# EAGLE design sensor Destama RN (EAGLE 9.6.2)
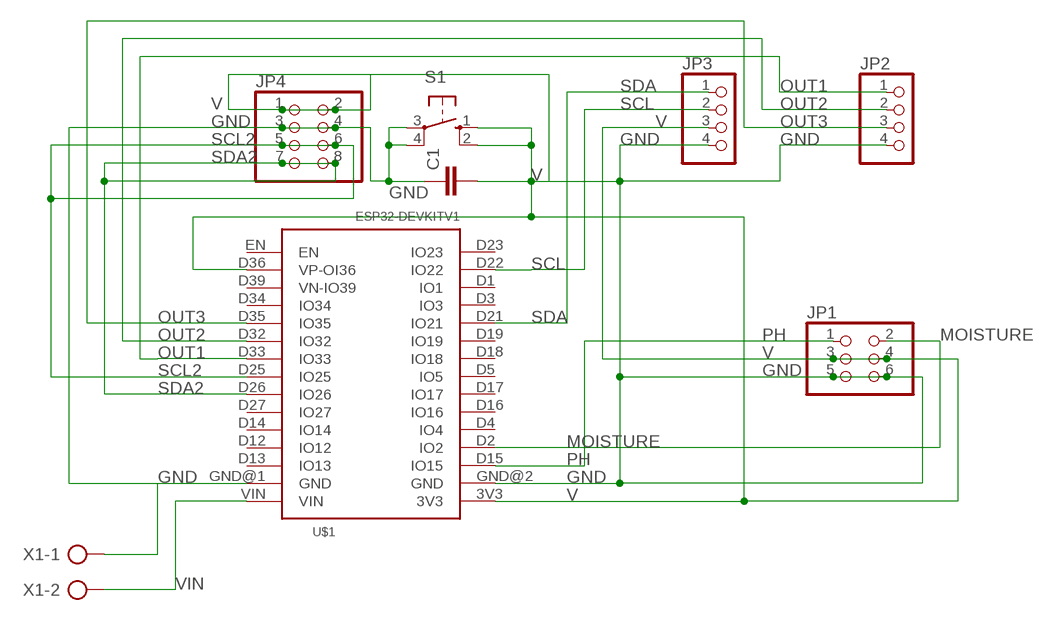
[diagram p0: schematic, sheet 1]

## Parts
C1  C-EU050-030X075  [C050-030X075]
JP1  PINHD-2X3  [2X03]
JP2  PINHD-1X4  [1X04]
JP3  PINHD-1X4  [1X04]
JP4  PINHD-2X4  [2X04]
S1  10-XX  [B3F-10XX]
U$1  ESP32DEVKITV1  [ESP32-DEVKITV1]
X1  AK300/2  [AK300/2]

## Nets
GND: C1.1 JP1.5 JP1.6 JP2.4 JP3.4 JP4.3 JP4.4 S1.3(P) S1.4(P1) U$1.GND@1(GND) U$1.GND@2(GND) X1.1
MOISTURE: JP1.2 U$1.D2(IO2)
OUT1: JP2.1 U$1.D33(IO33)
OUT2: JP2.2 U$1.D32(IO32)
OUT3: JP2.3 U$1.D35(IO35)
PH: JP1.1 U$1.D15(IO15)
SCL: JP3.2 U$1.D22(IO22)
SCL2: JP4.5 JP4.6 U$1.D25(IO25)
SDA: JP3.1 U$1.D21(IO21)
SDA2: JP4.7 JP4.8 U$1.D26(IO26)
V: C1.2 JP1.3 JP1.4 JP3.3 JP4.1 JP4.2 S1.1(S) S1.2(S1) U$1.3V3 U$1.D36(VP-OI36)
VIN: U$1.VIN X1.2
Unconnected: U$1.D1(IO1) U$1.D3(IO3) U$1.D4(IO4) U$1.D5(IO5) U$1.D12(IO12) U$1.D13(IO13) U$1.D14(IO14) U$1.D16(IO16) U$1.D17(IO17) U$1.D18(IO18) U$1.D19(IO19) U$1.D23(IO23) U$1.D27(IO27) U$1.D34(IO34) U$1.D39(VN-IO39) U$1.EN

## Library data of the parts
C1 = rcl:C-EU: CAPACITOR, European symbol; SPICEPREFIX: C
JP1 = pinhead:PINHD-2X3: PIN HEADER
JP2 JP3 = pinhead:PINHD-1X4: PIN HEADER
JP4 = pinhead:PINHD-2X4: PIN HEADER
S1 = switch-omron:10-XX: OMRON SWITCH; MPN: B3F-1000; OC_FARNELL: 176432; OC_NEWARK: 36M3542
U$1 = esp32-devkitv1:ESP32DEVKITV1
X1 = con-ptr500:AK300/2: CONNECTOR; OC_FARNELL: unknown; OC_NEWARK: unknown

## Board
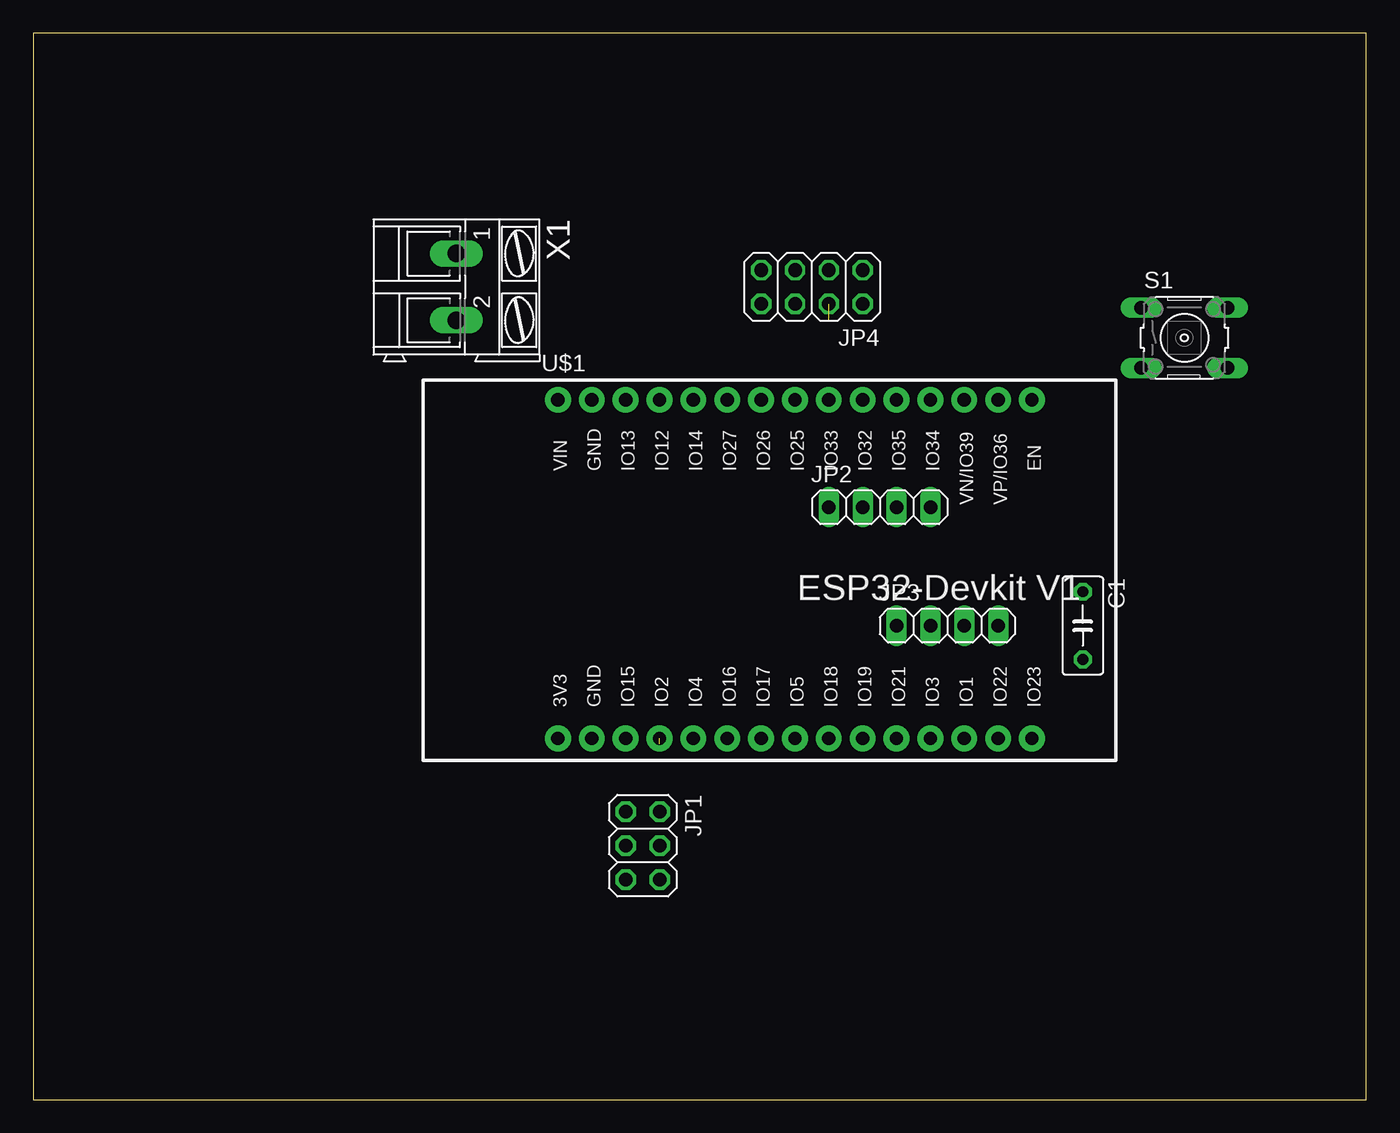
[diagram p1: board, top side]
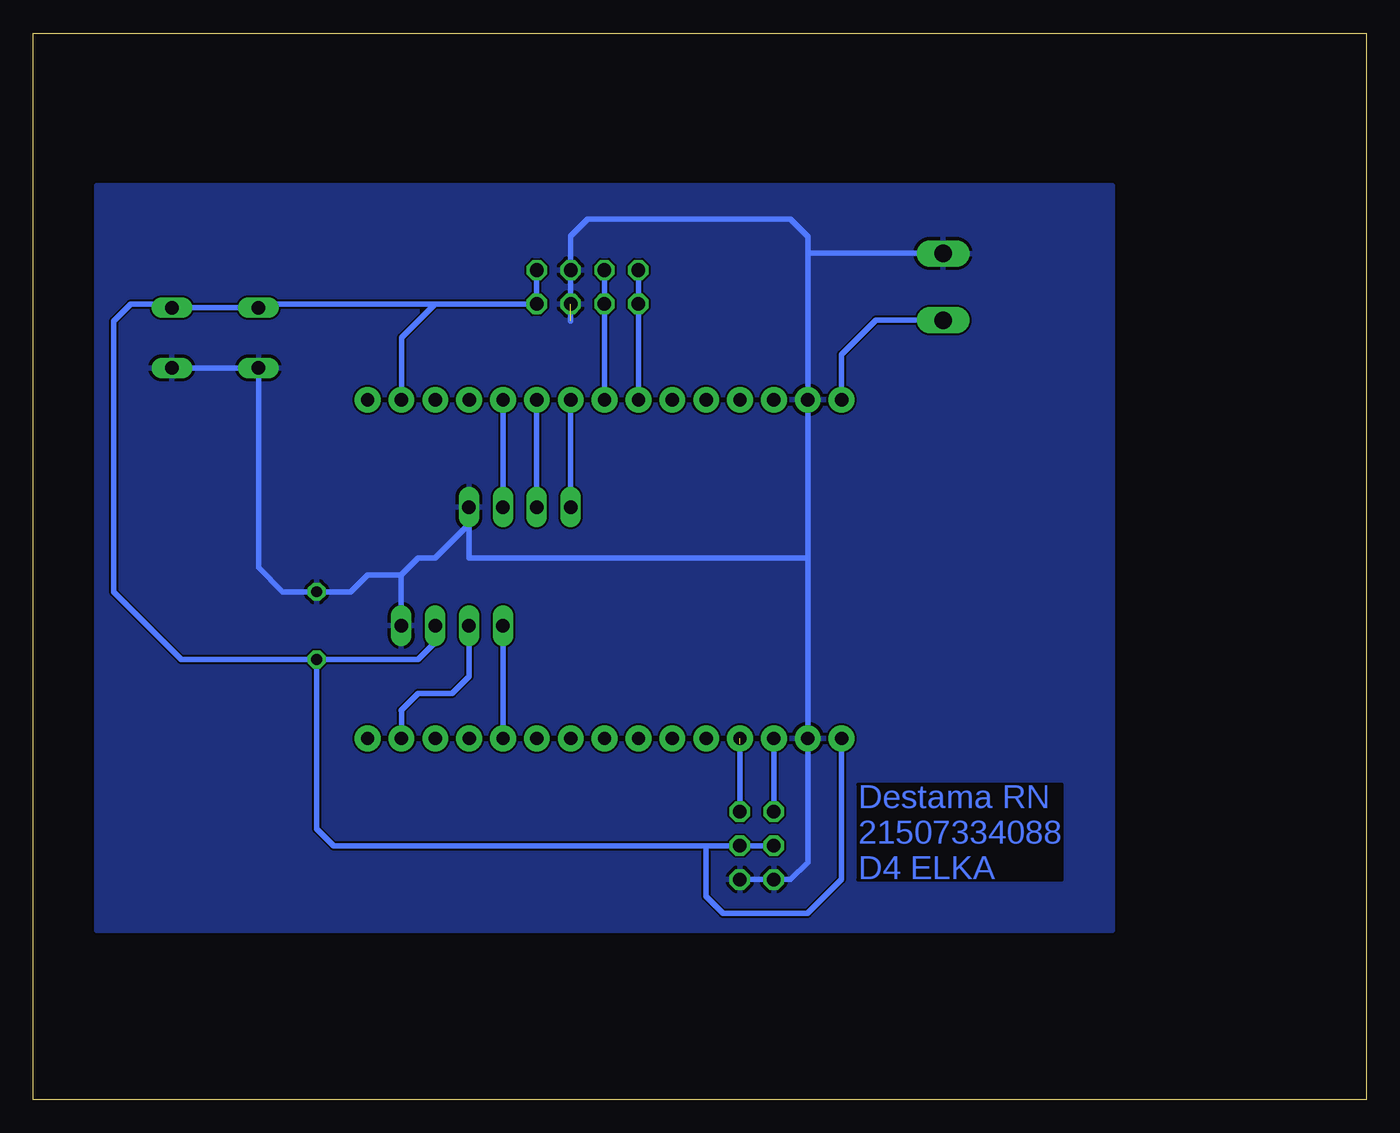
[diagram p2: board, bottom side, seen from below]

Size 100 x 80 mm. Coordinates in mm from the lower left corner, seen from the top.
Outline: 0,0 100,0 100,80 0,80 0,0
Copper layers (1*16): Top 0.035mm / dielectric 1.5mm / Bottom 0.035mm
Design rules "default": minimum track width 6mil, minimum drill 0.35mm, track to track 6mil, track to pad 6mil, pad to pad 6mil, via to via 6mil, smd to smd 6mil, copper to edge 40mil, drill to drill 6mil, minimum pad ring 10mil, minimum via ring 8mil, stop-mask expansion 4mil, vias tented up to drill 0mil, thermal gap 10mil

### Footprints (pad centres in the part's own frame; a part is rotated, then mirrored left to right if it is on the bottom)
C050-030X075 = drill 0.813 octagon: 1 -2.54,0; 2 2.54,0
2X03 = drill 1.016 octagon: 1 -2.54,-1.27; 2 -2.54,1.27; 3 0,-1.27; 4 0,1.27; 5 2.54,-1.27; 6 2.54,1.27
1X04 = drill 1.016 long: 1 -3.81,0; 2 -1.27,0; 3 1.27,0; 4 3.81,0
2X04 = drill 1.016 octagon: 1 -3.81,-1.27; 2 -3.81,1.27; 3 -1.27,-1.27; 4 -1.27,1.27; 5 1.27,-1.27; 6 1.27,1.27; 7 3.81,-1.27; 8 3.81,1.27
B3F-10XX = drill 1.016 long: 1 -3.251,2.261; 2 3.251,2.261; 3 -3.251,-2.261; 4 3.251,-2.261
ESP32-DEVKITV1 = drill 1 pad 1.93: 3V3 -16.52,-12.27; D1 13.96,-12.27; D2 -8.9,-12.27; D3 11.42,-12.27; D4 -6.36,-12.27; D5 1.26,-12.27; D12 -8.9,13.135; D13 -11.44,13.135; D14 -6.36,13.135; D15 -11.44,-12.27; D16 -3.82,-12.27; D17 -1.28,-12.27; D18 3.8,-12.27; D19 6.34,-12.27; D21 8.88,-12.27; D22 16.5,-12.27; D23 19.04,-12.27; D25 1.26,13.135; D26 -1.28,13.135; D27 -3.82,13.135; D32 6.34,13.135; D33 3.8,13.135; D34 11.42,13.135; D35 8.88,13.135; D36 16.5,13.135; D39 13.96,13.135; EN 19.04,13.135; GND@1 -13.98,13.135; GND@2 -13.98,-12.27; VIN -16.52,13.135
AK300/2 = drill 1.321 long: 1 -2.515,0; 2 2.489,0

### Placement (x,y rotation side)
C1  78.74,35.56 270 top
JP1  45.72,19.05 270 top
JP2  63.5,44.45 0 top
JP3  68.58,35.56 0 top
JP4  58.42,60.96 180 top
S1  86.36,57.15 0 top
U$1  55.88,39.37 0 top
X1  31.75,60.96 270 top

### Tracks (layer width: path | path; a pad name or v marks a point on that pad's centre or on a via)
GND  (1 unrouted)
  Bottom 0.406: JP3.4 72.39,39.37 | 72.39,39.37 71.12,40.64 69.85,40.64 67.31,43.18 JP2.4 67.31,40.64 41.9,40.64 | 72.39,39.37 74.93,39.37 76.2,38.1 C1.1 81.28,38.1 83.11,39.93 S1.3 S1.4 | 59.69,58.42 JP4.3 59.69,64.77 58.42,66.04 43.18,66.04 41.9,64.76 41.9,63.5 | JP1.6 JP1.5 43.18,16.51 41.9,17.79 U$1.GND@2 41.9,40.64 | 41.9,40.64 U$1.GND@1 41.9,63.5 | X1.1 31.77,63.5 41.9,63.5
  pour Bottom: 19.05,67.31 19.05,12.7 95.25,12.7 95.25,68.58 19.05,68.58
MOISTURE  (1 unrouted)
  Bottom 0.406: JP1.2 46.99,26.67
OUT1
  Bottom 0.406: U$1.D33 JP2.1
OUT2
  Bottom 0.406: U$1.D32 JP2.2
OUT3
  Bottom 0.406: U$1.D35 JP2.3
PH
  Bottom 0.406: JP1.1 U$1.D15
SCL
  Bottom 0.406: U$1.D22 72.38,29.2 72.39,29.21 71.12,30.48 68.58,30.48 67.31,31.75 JP3.2
SCL2
  Bottom 0.406: JP4.5 JP4.6 U$1.D25
SDA
  Bottom 0.406: JP3.1 U$1.D21
SDA2
  Bottom 0.406: U$1.D26 54.61,52.52 JP4.8 JP4.7
V
  Bottom 0.406: JP3.3 69.85,34.29 71.12,33.02 C1.2 | JP4.1 JP4.2 69.85,59.69 | C1.2 78.74,20.32 77.47,19.05 49.53,19.05 | 49.53,19.05 JP1.4 JP1.3 | 49.53,19.05 49.53,15.24 48.26,13.97 41.91,13.97 39.36,16.52 U$1.3V3 | C1.2 88.9,33.02 93.98,38.1 93.98,58.42 92.71,59.69 89.89,59.69 S1.2 83.82,59.41 | 83.82,59.41 S1.1 | U$1.D36 72.38,57.16 69.85,59.69 | 69.85,59.69 83.54,59.69 83.82,59.41
VIN
  Bottom 0.406: X1.2 36.78,58.47 39.36,55.89 U$1.VIN

### Text on the board
Bottom: Destama RN / 21507334088 / D4 ELKA